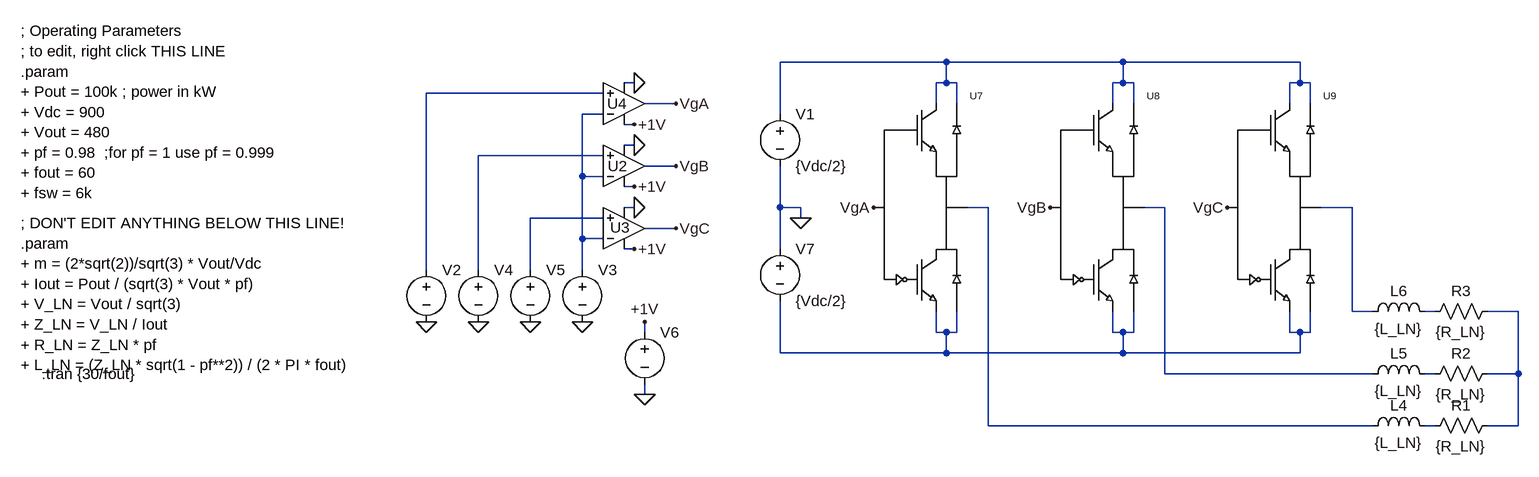
[diagram p0: schematic Inverter using HalfBridge blocks.asc]
Inverter using HalfBridge blocks.asc, the LTspice schematic file:
Version 4
SHEET 1 1528 800
WIRE 256 -64 0 -64
WIRE 528 -64 256 -64
WIRE 800 -64 528 -64
WIRE -224 -32 -240 -32
WIRE 256 -32 256 -64
WIRE 256 -32 240 -32
WIRE 272 -32 256 -32
WIRE 528 -32 528 -64
WIRE 528 -32 512 -32
WIRE 544 -32 528 -32
WIRE 800 -32 800 -64
WIRE 800 -32 784 -32
WIRE 816 -32 800 -32
WIRE -272 -16 -544 -16
WIRE -160 0 -208 0
WIRE 240 0 240 -32
WIRE 272 0 272 -32
WIRE 512 0 512 -32
WIRE 544 0 544 -32
WIRE 784 0 784 -32
WIRE 816 0 816 -32
WIRE -272 16 -304 16
WIRE 0 16 0 -64
WIRE -224 32 -240 32
WIRE -224 64 -240 64
WIRE -272 80 -464 80
WIRE -160 96 -208 96
WIRE -304 112 -304 16
WIRE -272 112 -304 112
WIRE -224 128 -240 128
WIRE -224 160 -240 160
WIRE 0 160 0 96
WIRE 32 160 0 160
WIRE 320 160 288 160
WIRE 592 160 560 160
WIRE 880 160 832 160
WIRE -272 176 -384 176
WIRE 32 176 32 160
WIRE -160 192 -208 192
WIRE -304 208 -304 112
WIRE -272 208 -304 208
WIRE -224 224 -240 224
WIRE 0 224 0 160
WIRE -544 256 -544 -16
WIRE -464 256 -464 80
WIRE -384 256 -384 176
WIRE -304 256 -304 208
WIRE 880 320 880 160
WIRE 912 320 880 320
WIRE 1008 320 992 320
WIRE 1136 320 1088 320
WIRE -208 352 -208 336
WIRE 240 352 240 320
WIRE 256 352 240 352
WIRE 272 352 272 320
WIRE 272 352 256 352
WIRE 512 352 512 320
WIRE 528 352 512 352
WIRE 544 352 544 320
WIRE 544 352 528 352
WIRE 784 352 784 320
WIRE 800 352 784 352
WIRE 816 352 816 320
WIRE 816 352 800 352
WIRE 0 384 0 304
WIRE 256 384 256 352
WIRE 256 384 0 384
WIRE 528 384 528 352
WIRE 528 384 256 384
WIRE 800 384 800 352
WIRE 800 384 528 384
WIRE 592 416 592 160
WIRE 912 416 592 416
WIRE 1008 416 992 416
WIRE 1136 416 1136 320
WIRE 1136 416 1088 416
WIRE -208 448 -208 432
WIRE 320 496 320 160
WIRE 912 496 320 496
WIRE 1008 496 992 496
WIRE 1136 496 1136 416
WIRE 1136 496 1088 496
FLAG -544 336 0
FLAG -464 336 0
FLAG -384 336 0
FLAG -304 336 0
FLAG -224 32 +1V
FLAG -224 128 +1V
FLAG -224 224 +1V
FLAG -208 336 +1V
FLAG -208 448 0
FLAG -160 0 VgA
FLAG -160 96 VgB
FLAG -160 192 VgC
FLAG -224 -32 0
FLAG -224 64 0
FLAG -224 160 0
FLAG 144 160 VgA
FLAG 416 160 VgB
FLAG 688 160 VgC
FLAG 32 176 0
SYMBOL voltage 0 0 R0
WINDOW 123 0 0 Left 2
WINDOW 39 0 0 Left 2
SYMATTR InstName V1
SYMATTR Value {Vdc/2}
SYMBOL voltage -544 240 R0
WINDOW 3 24 104 Invisible 2
WINDOW 123 0 0 Left 2
WINDOW 39 0 0 Left 2
SYMATTR Value SINE(0 {m} {fout} 0 0 0)
SYMATTR InstName V2
SYMBOL voltage -304 240 R0
WINDOW 123 0 0 Left 2
WINDOW 39 0 0 Left 2
WINDOW 3 24 104 Invisible 2
SYMATTR Value PULSE(-1 1 0 {1/(2*fsw)} {1/(2*fsw)} 0 {1/fsw})
SYMATTR InstName V3
SYMBOL voltage -464 240 R0
WINDOW 3 24 104 Invisible 2
WINDOW 123 0 0 Left 2
WINDOW 39 0 0 Left 2
SYMATTR Value SINE(0 {m} {fout} 0 0 120)
SYMATTR InstName V4
SYMBOL voltage -384 240 R0
WINDOW 3 24 104 Invisible 2
WINDOW 123 0 0 Left 2
WINDOW 39 0 0 Left 2
SYMATTR Value SINE(0 {m} {fout} 0 0 240)
SYMATTR InstName V5
SYMBOL Opamps\\UniversalOpamp2 -240 96 M180
WINDOW 0 -25 0 Left 2
SYMATTR InstName U2
SYMBOL Opamps\\UniversalOpamp2 -240 192 M180
WINDOW 0 -21 1 Left 2
SYMATTR InstName U3
SYMBOL Opamps\\UniversalOpamp2 -240 0 M180
WINDOW 0 -26 0 Left 2
SYMATTR InstName U4
SYMBOL voltage -208 336 R0
WINDOW 3 24 104 Invisible 2
WINDOW 123 0 0 Left 2
WINDOW 39 0 0 Left 2
SYMATTR Value 1
SYMATTR InstName V6
SYMBOL ind 896 512 R270
WINDOW 0 32 56 VTop 2
WINDOW 3 5 56 VBottom 2
SYMATTR InstName L4
SYMATTR Value {L_LN}
SYMBOL ind 896 432 R270
WINDOW 0 32 56 VTop 2
WINDOW 3 5 56 VBottom 2
SYMATTR InstName L5
SYMATTR Value {L_LN}
SYMBOL ind 896 336 R270
WINDOW 3 5 56 VBottom 2
WINDOW 0 32 56 VTop 2
SYMATTR Value {L_LN}
SYMATTR InstName L6
SYMBOL res 992 512 R270
WINDOW 0 32 56 VTop 2
WINDOW 3 0 56 VBottom 2
SYMATTR InstName R1
SYMATTR Value {R_LN}
SYMBOL res 992 432 R270
WINDOW 0 32 56 VTop 2
WINDOW 3 0 56 VBottom 2
SYMATTR InstName R2
SYMATTR Value {R_LN}
SYMBOL res 992 336 R270
WINDOW 0 32 56 VTop 2
WINDOW 3 0 56 VBottom 2
SYMATTR InstName R3
SYMATTR Value {R_LN}
SYMBOL IDEAL_Halfbridge 224 160 R0
SYMATTR InstName U7
SYMBOL IDEAL_Halfbridge 496 160 R0
SYMATTR InstName U8
SYMBOL IDEAL_Halfbridge 768 160 R0
SYMATTR InstName U9
SYMBOL voltage 0 208 R0
WINDOW 123 0 0 Left 2
WINDOW 39 0 0 Left 2
SYMATTR InstName V7
SYMATTR Value {Vdc/2}
TEXT -1136 416 Left 2 !.tran {30/fout}
TEXT -1168 -112 Left 2 !; Operating Parameters\n; to edit, right click THIS LINE\n.param\n+ Pout = 100k ; power in kW\n+ Vdc = 900\n+ Vout = 480\n+ pf = 0.98  ;for pf = 1 use pf = 0.999\n+ fout = 60\n+ fsw = 6k
TEXT -1168 184 Left 2 !; DON'T EDIT ANYTHING BELOW THIS LINE!\n.param\n+ m = (2*sqrt(2))/sqrt(3) * Vout/Vdc\n+ Iout = Pout / (sqrt(3) * Vout * pf)\n+ V_LN = Vout / sqrt(3)\n+ Z_LN = V_LN / Iout\n+ R_LN = Z_LN * pf\n+ L_LN = (Z_LN * sqrt(1 - pf**2)) / (2 * PI * fout)

The netlist it stands for:
* Inverter using HalfBridge blocks.asc
V1 N001 0 {Vdc/2}
V2 N002 0 SINE(0 {m} {fout} 0 0 0)
V3 N003 0 PULSE(-1 1 0 {1/(2*fsw)} {1/(2*fsw)} 0 {1/fsw})
V4 N004 0 SINE(0 {m} {fout} 0 0 120)
V5 N008 0 SINE(0 {m} {fout} 0 0 240)
XU2 N004 N003 +1V 0 VgB level.2 Avol=1Meg GBW=10Meg Slew=10Meg ilimit=25m rail=0 Vos=0 phimargin=45 en=0 enk=0 in=0 ink=0 Rin=500Meg  ; pins IN+ IN- V+ V- OUT
XU3 N008 N003 +1V 0 VgC level.2 Avol=1Meg GBW=10Meg Slew=10Meg ilimit=25m rail=0 Vos=0 phimargin=45 en=0 enk=0 in=0 ink=0 Rin=500Meg  ; pins IN+ IN- V+ V- OUT
XU4 N002 N003 +1V 0 VgA level.2 Avol=1Meg GBW=10Meg Slew=10Meg ilimit=25m rail=0 Vos=0 phimargin=45 en=0 enk=0 in=0 ink=0 Rin=500Meg  ; pins IN+ IN- V+ V- OUT
V6 +1V 0 1
L4 N005 N013 {L_LN}
L5 N006 N012 {L_LN}
L6 N007 N009 {L_LN}
R1 N013 N010 {R_LN}
R2 N012 N010 {R_LN}
R3 N009 N010 {R_LN}
XU7 VgA N001 N001 N005 N011 N011 IDEAL_Halfbridge  ; pins G+ C1 K1 AC E2 A2
XU8 VgB N001 N001 N006 N011 N011 IDEAL_Halfbridge  ; pins G+ C1 K1 AC E2 A2
XU9 VgC N001 N001 N007 N011 N011 IDEAL_Halfbridge  ; pins G+ C1 K1 AC E2 A2
V7 0 N011 {Vdc/2}
.tran {30/fout}
; Operating Parameters
; to edit, right click THIS LINE
.param
+ Pout = 100k ; power in kW
+ Vdc = 900
+ Vout = 480
+ pf = 0.98  ;for pf = 1 use pf = 0.999
+ fout = 60
+ fsw = 6k
; DON'T EDIT ANYTHING BELOW THIS LINE!
.param
+ m = (2*sqrt(2))/sqrt(3) * Vout/Vdc
+ Iout = Pout / (sqrt(3) * Vout * pf)
+ V_LN = Vout / sqrt(3)
+ Z_LN = V_LN / Iout
+ R_LN = Z_LN * pf
+ L_LN = (Z_LN * sqrt(1 - pf**2)) / (2 * PI * fout)
.lib UniversalOpamps2.sub
.lib IDEAL_IGBT.lib
.backanno
.end